# Altium schematic sheet RaceSCH.SchDoc
size A4
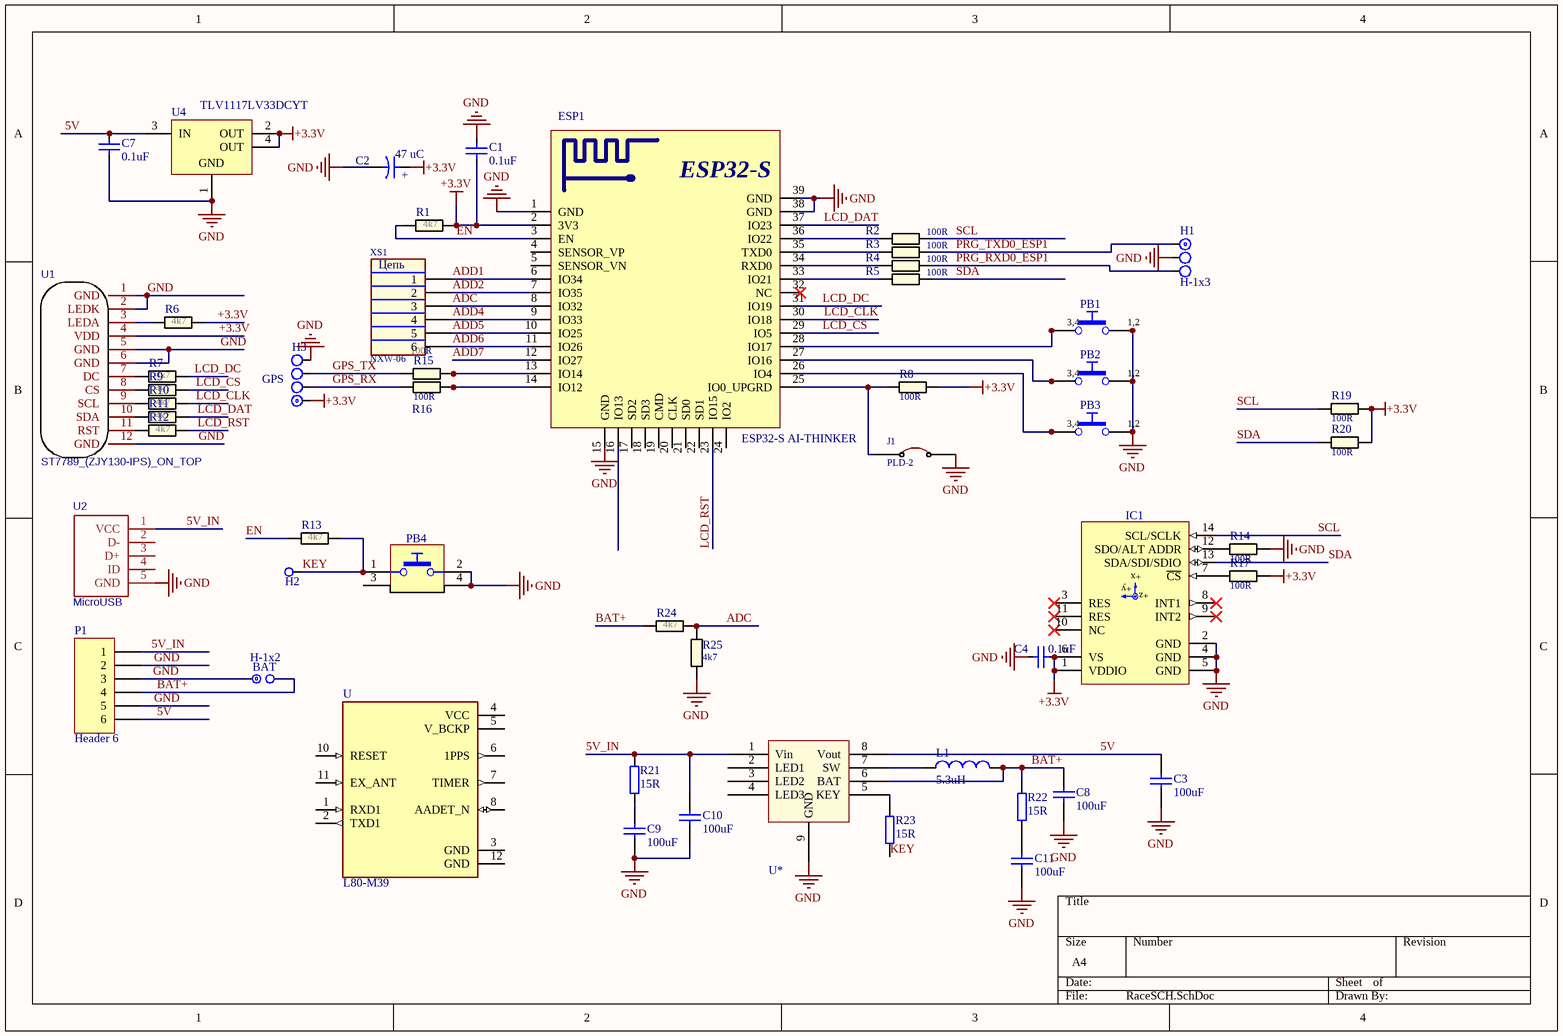
[diagram p0: RaceSCH.SchDoc]

## Parts
BAT  H-1x2  [J1x2]
C1  value 0.1uF  [C0603]
C2  47 uC  [CAPMP3528X210N]
C3  value 100uF  [CAP1210]  (hidden comment: CAP)
C4  value 0.1uF  [C0603]
C7  value 0.1uF  [C0603]
C8  value 100uF  [CAP1210]  (hidden comment: CAP)
C9  value 100uF  [CAP1210]  (hidden comment: CAP)
C10  value 100uF  [CAP1210]  (hidden comment: CAP)
C11  value 100uF  [CAP1210]  (hidden comment: CAP)
ESP1  ESP32-S AI-THINKER  [ESP32-S]
H1  H-1x3  [J1x3]
H2  H-1  [J1]  (value not drawn)
H3  GPS  [J1x4]
IC1  ADXL343BCCZ  [ANALOG-DEVICES_CC-14-1]  (value not drawn)
J1  PLD-2  [PLD-2]
L1  value 5.3uH  [SRR5028-4R2Y]  (hidden comment: INDUCTOR_2)
P1  Header 6  [HDR1X6]
PB1  Push Button  [PB_OMRON_B3F-1000]  (value not drawn)
PB2  Push Button  [PB_OMRON_B3F-1000]  (value not drawn)
PB3  Push Button  [PB_OMRON_B3F-1000]  (value not drawn)
PB4  Push Button  [PB_ALPS_SKHHLQA010]  (value not drawn)
R1  value 4k7  [R0603(1608)]  (hidden comment: RESISTOR)
R2  value 100R  [R0603(1608)]  (hidden comment: RESISTOR)
R3  value 100R  [R0603(1608)]  (hidden comment: RESISTOR)
R4  value 100R  [R0603(1608)]  (hidden comment: RESISTOR)
R5  value 100R  [R0603(1608)]  (hidden comment: RESISTOR)
R6  value 4k7  [R0603(1608)]  (hidden comment: RESISTOR)
R7  value 4k7  [R0603(1608)]  (hidden comment: RESISTOR)
R8  value 100R  [R0603(1608)]  (hidden comment: RESISTOR)
R9  value 4k7  [R0603(1608)]  (hidden comment: RESISTOR)
R10  value 4k7  [R0603(1608)]  (hidden comment: RESISTOR)
R11  value 4k7  [R0603(1608)]  (hidden comment: RESISTOR)
R12  value 4k7  [R0603(1608)]  (hidden comment: RESISTOR)
R13  value 4k7  [R0603(1608)]  (hidden comment: RESISTOR)
R14  value 100R  [R0603(1608)]  (hidden comment: RESISTOR)
R15  value 100R  [R0603(1608)]  (hidden comment: RESISTOR)
R16  value 100R  [R0603(1608)]  (hidden comment: RESISTOR)
R17  value 100R  [R0603(1608)]  (hidden comment: RESISTOR)
R19  value 100R  [R0603(1608)]  (hidden comment: RESISTOR)
R20  value 100R  [R0603(1608)]  (hidden comment: RESISTOR)
R21  value 15R  [RES0603]  (hidden comment: RES)
R22  value 15R  [RES0603]  (hidden comment: RES)
R23  value 15R  [RES0603]  (hidden comment: RES)
R24  value 4k7  [R0603(1608)]  (hidden comment: RESISTOR)
R25  value 4k7  [R0603(1608)]  (hidden comment: RESISTOR)
U  L80-M39  [XCVR_L80-M39]
U1  ST7789_(ZJY130-IPS)_ON_TOP  [ST7789_ON_TOP]
U2  MicroUSB  [MICROUSB]
U4  TLV1117LV33DCYT  [TI-DCY4_N]
U*  IP5306  [IP5306_GND]  (value not drawn)
XS1  NXW-06  [NXW-06]

## Nets
+3.3V: C1.2 C2.1 C4.1 ESP1.2(3V3) H3.1 IC1.1(VDDIO) IC1.6(VS) R1.2 R6.2 R8.2 R17.2 R19.1 R20.1 U1.4(VDD) U4.2(OUT) U4.4(OUT)
GND: BAT.1 C1.1 C2.2 C3.1 C4.2 C7.2 C8.1 C9.1 C10.1 C11.1 ESP1.1(GND) ESP1.15(GND) ESP1.38(GND) ESP1.39(GND) H1.2 H3.4 IC1.2(GND) IC1.4(GND) IC1.5(GND) J1.2 P1.2 P1.3 P1.5 PB1.1 PB1.2 PB2.1 PB2.2 PB3.1 PB3.2 PB4.2 PB4.4 R14.1 R25.1 U1.1(GND) U1.2(LEDK) U1.5(GND) U1.6(GND) U1.12(GND) U2.5(GND) U4.1(GND) U*.9(GND)
5V: C3.2 C7.1 P1.6 U4.3(IN) U*.8(Vout)
5V_IN: C10.2 P1.1 R21.2 U2.1(VCC) U*.1(Vin)
ADC: ESP1.8(IO32) R24.2 R25.2 XS1.3
ADD1: ESP1.6(IO34) XS1.1
ADD2: ESP1.7(IO35) XS1.2
ADD4: ESP1.9(IO33) XS1.4
ADD5: ESP1.10(IO25) XS1.5
ADD6: ESP1.11(IO26) XS1.6
ADD7: ESP1.12(IO27)
BAT+: BAT.2 C8.2 L1.2 P1.4 R22.2 R24.1 U*.6(BAT)
EN: ESP1.3(EN) R1.1 R13.1
GPS_RX: H3.2 R16.1
GPS_TX: H3.3 R15.1
KEY: H2.1 PB4.1 R13.2 R23.1
LCD_CLK: ESP1.30(IO18) R10.2
LCD_CS: ESP1.29(IO5) R9.2
LCD_DAT: ESP1.37(IO23) R11.2
LCD_DC: ESP1.31(IO19) R7.2
LCD_RST: ESP1.23(IO15) R12.2
PRG_RXD0_ESP1: H1.3 R4.1
PRG_TXD0_ESP1: H1.1 R3.1
SCL: IC1.14(SCL/SCLK) R2.1 R19.2
SDA: IC1.13(SDA/SDI/SDIO) R5.1 R20.2
NetC9_2: C9.2 R21.1
NetC11_2: C11.2 R22.1
NetESP1_13: ESP1.13(IO14) R15.2
NetESP1_14: ESP1.14(IO12) R16.2
NetESP1_25: ESP1.25(IO0_UPGRD) J1.1 R8.1
NetESP1_26: ESP1.26(IO4) PB3.3 PB3.4
NetESP1_27: ESP1.27(IO16) PB2.3 PB2.4
NetESP1_28: ESP1.28(IO17) PB1.3 PB1.4
NetESP1_33: ESP1.33(IO21) R5.2
NetESP1_34: ESP1.34(RXD0) R4.2
NetESP1_35: ESP1.35(TXD0) R3.2
NetESP1_36: ESP1.36(IO22) R2.2
NetIC1_7: IC1.7(~{CS}) R17.1
NetIC1_12: IC1.12(SDO/ALT_ADDR) R14.2
NetL1_1: L1.1 U*.7(SW)
NetR6_1: R6.1 U1.3(LEDA)
NetR7_1: R7.1 U1.7(DC)
NetR9_1: R9.1 U1.8(CS)
NetR10_1: R10.1 U1.9(SCL)
NetR11_1: R11.1 U1.10(SDA)
NetR12_1: R12.1 U1.11(RST)
NetR23_2: R23.2 U*.5(KEY)

Not connected (* = marked no-connect by the designer): ESP1 4(SENSOR_VP) 5(SENSOR_VN) 16(IO13) 17(SD2) 18(SD3) 19(CMD) 20(CLK) 21(SD0) 22(SD1) 24(IO2) 32(NC)*; IC1 3(RES)* 8(INT1)* 9(INT2)* 10(NC)* 11(RES)*; PB4 3; U 1(RXD1) 2(TXD1) 3(GND) 4(VCC) 5(V_BCKP) 6(1PPS) 7(TIMER) 8(AADET_N) 10(RESET) 11(EX_ANT) 12(GND); U2 2(D-) 3(D+) 4(ID); U* 2(LED1) 3(LED2) 4(LED3)

## Notes on the sheet
- (in symbol ADXL343BCCZ) +x; +y; +z
- (in symbol CTE3528-21_100UF_6.3V_10%) +
- (in symbol ESP32-S AI-THINKER) ESP32-S
- (in symbol NXW-06) Цепь
- (in symbol PB_OMRON_B3F-1000) 3,4; 1,2

## Library data of the parts
C1 C4 C7 = CAPACITOR: Конденсатор; Название: Конденсатор
C2 = CTE3528-21_100UF_6.3V_10%: Polarised capacitor; Part Description: Solid Tantalum Chip Capacitor; Manufacturer: GENERIC; Manufacturer1 Part Number: TAJB107K006R; Value: 100uF; Voltage: 6.3V; Tolerance: ±10%; Table: Capacitors SMD; Part Number: CTE3528-21_100UF_6.3V_10%; Component Kind: Standard; Component Type: Standard; Pin Count: 2; Status: Preferred; Manufacturer Part Number: CTE3528-21_100UF_6.3V_10%; Case: B; Mounted: Yes; Socket: No; SMD: Yes; Manufacturer1 Example: AVX; Manufacturer1 ComponentHeight: 2.1mm; HelpURL: \\cern.ch\dfs\Applications\Altium\Datasheets\CTE_AVX_TAJ.pdf; Author: CERN DEM JLC; CreateDate: 03.12.2007; LatestRevisionDate: 03.12.2007
C3 C8-C11 = CAP-SM-1210-X5R-100uF-6.3V: CAP SM 1210 X5R 100uF 6.3V 10%; Manufacturer: GENERIC; Part Number: CAP-SM-1210-X5R-100uF-6.3V; Package: 1210
ESP1 = ESP32-S AI-THINKER: Wi-Fi module
H3 = H-1x4: Price: 0.04
IC1 = ADXL343BCCZ: 3-Axis, ±2g/±4g/±8g/±16g Digital MEMS Accelerometer; Manufacturer: ANALOG DEVICES; Table: Sensors; Part Number: ADXL343BCCZ; Component Kind: Standard; Component Type: Standard; Device: ADXL343BCCZ; PackageDescription: LGA, 0.50mm pitch, 14 Pin, 3.00mm L X 5.00mm W X 1.00mm H body, ANALOG DEVICE CC-14-1; Part Description: 3-Axis, ±2g/±4g/±8g/±16g Digital MEMS Accelerometer; Manufacturer Part Number: ADXL343BCCZ; Pin Count: 14; Case: LGA14; Mounted: Yes; Socket: No; SMD: Yes; ComponentHeight: 1mm; HelpURL: \\cern.ch\dfs\Applications\Altium\Datasheets\ADXL343BCCZ.pdf; Author: CERN DEM JLC; CreateDate: 03.06.2014; LatestRevisionDate: 03.06.2014
J1 = PLD-2: Название: Разъём
L1 = INDUCTOR_2: Код заказа (Артикул): SRR5028-5R3YCT
P1 = Header 6: Header, 6-Pin; LatestRevisionDate: 17-Jul-2002; LatestRevisionNote: Re-released for DXP Platform.; Publisher: Altium Limited
PB1-PB3 = PB_OMRON_B3F-1000: Push-Button Switch SPDT; Part Description: 24VDC 50mA SPST-NO Tactile Push-Button Switch (h=4.5mm); Manufacturer: OMRON; Table: Switches; Part Number: PB_OMRON_B3F-1000; Component Kind: Standard; Component Type: Standard; Pin Count: 4; PackageDescription: 6x6mm Model, Horizontal, Flat Plunger Type (without Ground Terminal) Pushbutton Switch, OMRON B3F Series; Family: Push Button; Mounted: Yes; Socket: No; SMD: No; Status: None; Manufacturer Part Number: B3F-1000; ComponentHeight: 4.5mm; HelpURL: \\cern.ch\dfs\Applications\Altium\Datasheets\PB_OMRON_B3F-1000.pdf; Author: CERN DEM JMW; CreateDate: 23.10.2008; LatestRevisionDate: 06.05.2009
PB4 = PB_ALPS_SKHHLQA010: Push-Button Switch SPDT; Part Description: 6x6mm, SPST Horizontal Pushbutton Switch, Stem height 8.35mm, Contact Rating 50mA 12VDC, Serie SKHH; Manufacturer: ALPS; Table: Switches; Part Number: PB_ALPS_SKHHLQA010; Component Kind: Standard; Component Type: Standard; Pin Count: 4; PackageDescription: Body 6x6mm, Stem height 8.35mm, Horizontal Pushbutton Switch, ALPS Serie SKHH; Family: Push Button; Mounted: Yes; Socket: No; SMD: No; Status: None; Manufacturer Part Number: SKHHLQA010; ComponentHeight: 7.4mm; HelpURL: \\cern.ch\dfs\Applications\Altium\Datasheets\PB_ALPS_SKHHLQA010.pdf; Author: CERN DEM JLC; CreateDate: 15.01.2009; LatestRevisionDate: 15.01.2009
R1-R17 R19 R20 R24 R25 = RESISTOR: Название: Резистор
R21-R23 = RES-SM-0603-15R: RES SM 0603 15R; Manufacturer: GENERIC; Part Number: RES-SM-0603-15R; Package: 0603
U = L80-M39: L80 is an ultra compact GPS POT _Patch on Top_ module with an embedded 15.0mm Ã— 15.0mm Ã— 4.0mm patch antenna.; MF: Quectel; SnapEDA_Link: https://www.snapeda.com/parts/L80-M39/Quectel/view-part/51186/?ref=snap; Availability: Unavailable; MP: L80-M39; Price: None; Value: *; Package: None
U1 = ST7789_(ZJY130-IPS)_ON_TOP copy: Contributor: §°§Э§Ц§Ф §¬§а§б§Ц§Ы§Ь§Ъ§Я; BOM_Manufacturer Part: ?; BOM_Supplier Part: undefined; spicePre: U
U2 = MicroUSB: Contributor: SparkFun; sourceId: qPJDVoYkG; timeStamp: 1463643012; BOM_Manufacturer Part: ?; spicePre: U
U4 = TLV1117LV30DCYT: Single Output LDO, 1 A, Fixed 3 V Output, 2 to 5.5 V Input, 4-pin SOT-223 (DCY), -40 to 125 degC, Green (RoHS & no Sb/Br); Manufacturer: Texas Instruments; Accuracy(%): 2; Fixed Output Options(V): 3; Iout(Max)(A): 1; Iq(Typ)(mA): 0.05; SubFamily: Single Channel LDO; Vdo(Typ)(mV): 1200; Vin(Max)(V): 5.5; DatasheetVersion: SBVS160A; PackageVersion: 4202506/B; PackageReference: DCY4; PackageDescription: 4-Pin Plastic Small Outline, Body 3.5 x 6.5 mm, Pitch 2.3 mm; Supplier 1: Digi-Key; Supplier Part Number 1: 296-34848-2-ND; Supplier 2: Farnell; Supplier Part Number 2: 2214986; Supplier 3: Newark; Supplier Part Number 3: 45W6437; Supplier 4: Newark; Supplier Part Number 4: 27W9631; Supplier 5: Mouser; Supplier Part Number 5: 595-TLV1117LV30DCYT; Eco-Plan: Green (RoHS & no Sb/Br); Vin(Min)(V): 2; Vout Adj(Max)(V): 3; Vout Adj(Min)(V): 3; Mounting Technology: Surface Mount; Code_JEDEC: TO-261; PartNumber: TLV1117LV33DCYT; ComponentLink1Description: Manufacturer URL; ComponentLink1URL: http://www.ti.com/; ComponentLink2Description: Datasheet; ComponentLink2URL: http://www.ti.com/general/docs/lit/getliterature.tsp?genericPartNumber=TLV1117LV30&fileType=pdf; ComponentLink3Description: Package Specification; ComponentLink3URL: http://www.ti.com/litv/pdf/mpds094a
U* = IP5306: 2.1A_lipo_CHARGER
XS1 = NXW-06: 2.0mm pitch; Название: Разъём; Производитель: NINIGI; Код заказа (Артикул): NXW-06
BAT = H-1x2: Price: 0.02
H1 = H-1x3: Price: 0.03
H2 = H-1: Price: 0.01